# Altium schematic sheet Sheet1.SchDoc
size A; SheetNumber: 1; SheetTotal: 1
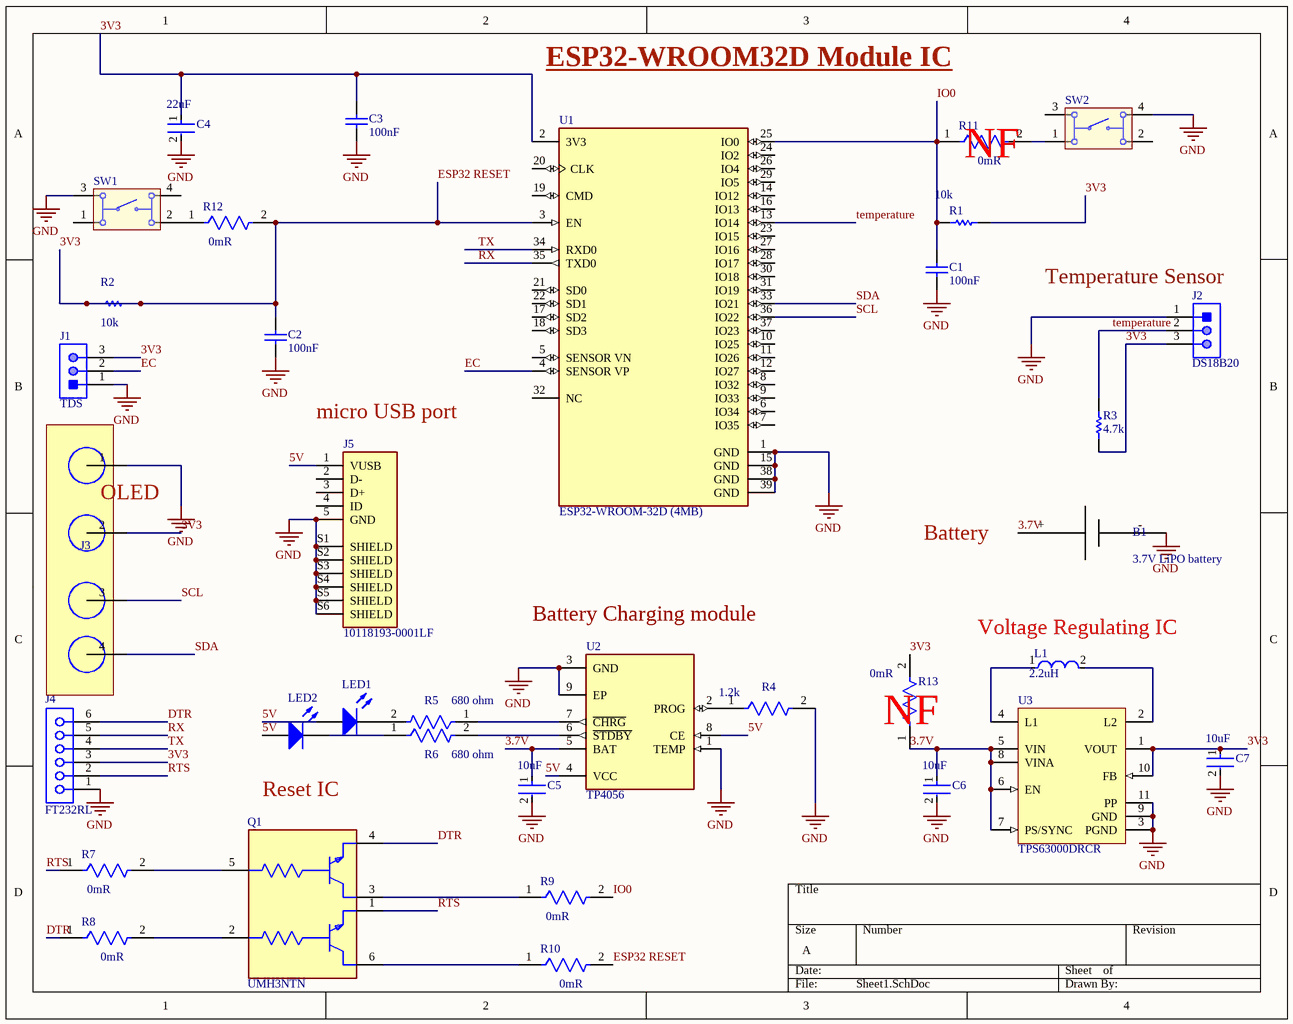
[diagram p0: Sheet1.SchDoc]

## Parts
B1  3.7V LiPO battery  [Battery_lipo]
C1  Capacitance: 100nF  [AVX-MD01]  (hidden comment: MD015E104MAB)
C2  Capacitance: 100nF  [AVX-MD01]  (hidden comment: MD015E104MAB)
C3  Capacitance: 100nF  [AVX-MD01]  (hidden comment: MD015E104MAB)
C4  Capacitance: 22uF  [FP-RCEWM1-MFG]  (hidden comment: RCER71E226MWM1H03A)
C5  Capacitance: 10uF  [FP-RCEWM1-MFG]  (hidden comment: RCER71H106MWK1H03B)
C6  Capacitance: 10uF  [FP-RAD-TH-D_6_3_0_5-L_7_1-MFG]  (hidden comment: ECEA1VKN100)
C7  Capacitance: 10uF  [FP-RAD-TH-D_6_3_0_5-L_7_1-MFG]  (hidden comment: ECEA1VKN100)
J1  TDS  [MOLX-22-23-2031_V]
J2  DS18B20  [MOLX-22-23-2031_V]
J3  OLED  [female header]  (value not drawn)
J4  FT232RL  [SMTC-SSW-106-02-X-S-RA]
J5  10118193-0001LF  [AMPHENOL_10118193-0001LF]
L1  Inductance: 2.2uH  [FP-LQM2HPN_J0-IPC_A]  (hidden comment: LQM2HPN2R2MJ0L)
LED1  151051BS04000  [Type 5mm]  (value not drawn)
LED2  151051BS04000  [Type 5mm]  (value not drawn)
Q1  UMH3NTN  [FP-UMT6-IPC_C]
R1  Resistance (Ohms): 10k  [OMTE-RES7X2.5-2]  (hidden comment: OD103JE)
R2  Resistance (Ohms): 10k  [OMTE-RES7X2.5-2]  (hidden comment: OD103JE)
R3  Resistance (Ohms): 4.7k  [OMTE-RES7X2.5-2]  (hidden comment: OD103JE)
R4  Resistance: 1.2k  [FP-MRS25-MFG]  (hidden comment: MRS25000C9530FCT00)
R5  Resistance: 680 ohm  [FP-MRS25-MFG]  (hidden comment: MRS25000C9530FCT00)
R6  Resistance: 680 ohm  [FP-MRS25-MFG]  (hidden comment: MRS25000C9530FCT00)
R7  Resistance: 0mR  [FP-ZOR-25-R-52-0R-MFG]  (hidden comment: ZOR-25-R-52-0R)
R8  Resistance: 0mR  [FP-ZOR-25-R-52-0R-MFG]  (hidden comment: ZOR-25-R-52-0R)
R9  Resistance: 0mR  [FP-ZOR-25-R-52-0R-MFG]  (hidden comment: ZOR-25-R-52-0R)
R10  Resistance: 0mR  [FP-ZOR-25-R-52-0R-MFG]  (hidden comment: ZOR-25-R-52-0R)
R11  Resistance: 0mR  [FP-ZOR-25-R-52-0R-MFG]  (hidden comment: ZOR-25-R-52-0R)
R12  Resistance: 0mR  [FP-ZOR-25-R-52-0R-MFG]  (hidden comment: ZOR-25-R-52-0R)
R13  Resistance: 0mR  [FP-ZOR-25-R-52-0R-MFG]  (hidden comment: ZOR-25-R-52-0R)
SW1  430156050726  [430156050726]  (value not drawn)
SW2  430156050726  [430156050726]  (value not drawn)
U1  ESP32-WROOM-32D (4MB)  [FP-ESP32-WROOM-32D_4MB-MFG]
U2  TP4056  [SOP127P600X175-9N]
U3  TPS63000DRCR  [DRC0010J_V]

## Nets
GND: B1.-(SDA) C1.1 C2.1 C3.1 C4.2 C5.2 C6.2 C7.2 J1.1 J2.1 J3.1 J4.1 J5.5(GND) J5.S1(SHIELD) J5.S2(SHIELD) J5.S3(SHIELD) J5.S4(SHIELD) J5.S5(SHIELD) J5.S6(SHIELD) R4.2 SW1.3 SW2.4 U1.1(GND) U1.15(GND) U1.38(GND) U1.39(GND) U2.1(TEMP) U2.3(GND) U2.9(EP) U3.3(PGND) U3.9(GND) U3.11(PP)
3.7V: B1.+(SDA) C5.1 C6.1 R13.1 U2.5(BAT) U3.5(VIN) U3.6(EN) U3.7(PS/SYNC) U3.8(VINA)
3V3: C2.2 C3.2 C4.1 C7.1 J1.3 J2.3 J3.2 J4.3 R1.2 R2.1 R2.2 R3.1 R10.2 R12.2 R13.2 U1.2(3V3) U1.3(EN) U3.1(VOUT) U3.10(FB)  [also labelled ESP32 RESET]
5V: J5.1(VUSB) LED1.2(A) LED2.2(A) U2.4(VCC) U2.8(CE)
DTR: J4.6 Q1.4(E) R8.1
EC: J1.2 U1.4(SENSOR_VP)
IO0: C1.2 R1.1 R9.2 R11.1 U1.25(IO0)
RTS: J4.2 Q1.1(E) R7.1
RX: J4.5 U1.35(TXD0)
SCL: J3.3 U1.36(IO22)
SDA: J3.4 U1.33(IO21)
temperature: J2.2 R3.2 U1.13(IO14)
TX: J4.4 U1.34(RXD0)
NetL1_1: L1.1 U3.4(L1)
NetL1_2: L1.2 U3.2(L2)
NetLED1_1: LED1.1(K) R5.2
NetLED2_1: LED2.1(K) R6.1
NetQ1_2: Q1.2(B) R8.2
NetQ1_3: Q1.3(C) R9.1
NetQ1_5: Q1.5(B) R7.2
NetQ1_6: Q1.6(C) R10.1
NetR4_1: R4.1 U2.2(PROG)
NetR5_1: R5.1 U2.7(~{CHRG})
NetR6_2: R6.2 U2.6(~{STDBY})
NetR11_2: R11.2 SW2.1
NetR12_1: R12.1 SW1.2

Not connected (* = marked no-connect by the designer): J5 2(D-) 3(D+) 4(ID); SW1 1 4; SW2 2 3; U1 5(SENSOR_VN) 6(IO34) 7(IO35) 8(IO32) 9(IO33) 10(IO25) 11(IO26) 12(IO27) 14(IO12) 16(IO13) 17(SD2) 18(SD3) 19(CMD) 20(CLK) 21(SD0) 22(SD1) 23(IO15) 24(IO2) 26(IO4) 27(IO16) 28(IO17) 29(IO5) 30(IO18) 31(IO19) 32(NC) 37(IO23)

## Notes on the sheet
- ESP32-WROOM32D Module IC
- (near R11) NF
- (near J2) Temperature Sensor
- (near J5) micro USB port
- (near J3) OLED
- Battery
- (near U2) Battery Charging module
- (near L1) Voltage Regulating IC
- (near R13) NF
- Reset IC

## Library data of the parts
B1 = Battery
C1-C3 = CMP-2000-06690-1: Ceramic Capacitor, 0.1 uF, +/- 20%, 50 V, -55 to 125 degC, 2-Pin THD (MD01), Bulk; Manufacturer: AVX; Dielectric: Z5U; Rated Voltage: 50V; Mounting Technology: ThroughHole; Case Size/Dimension: 6.6x3.43x2.54mm; Package Reference: AVX-MD01; Datasheet URL: http://datasheets.avx.com/dipguard.pdf; Package Description: 2-Pin Through Hole Device, Body 6.6 x 2.54 mm; Datasheet Version: 08/2015; Tolerance (%): ±20%; Manufacturer URL: http://www.avx.com/
C4 = CMP-06035-003622-1: CAP CER 22UF 25V X7R RADIAL; Tolerance: 20%; Lead Diameter: 0.5mm; Lead/Base Style: Formed Leads; Height - Seated (Max): 0.295inch; Height: 7.5mm; Max Operating Temperature: 125°C; Package Quantity: 1500; Case/Package: Radial; Length: 0.217inch; Lead Pitch: 0.197inch; Voltage Rating (DC): 25V; Ratings: AEC-Q200; Mount: Through Hole; Packaging: Tape and Reel; Voltage Rating: 25V; Min Operating Temperature: -55°C; Width: 0.157inch; Resistor Type: Ceramic; Termination: Radial; Dielectric: X7R
C5 = CMP-06035-035073-1: Cap Ceramic 10uF 50V X7R ±20% Radial 5mm +125°C Automotive Ammo Pack; Lead/Base Style: Formed Leads; Lead Diameter: 0.5mm; Width: 4mm; Max Operating Temperature: 125°C; Case/Package: Radial; Mount: Through Hole; Depth: 7.5mm; Dielectric: X7R; Tolerance: 20%; Length: 5.5mm; Min Operating Temperature: -55°C; Height: 7.5mm; Ratings: AEC-Q200; Voltage Rating: 50V; Lead Pitch: 0.197inch; Diameter: 5.5mm; Height - Seated (Max): 0.295inch; Voltage: 50V; Resistor Type: Ceramic; Voltage Rating (DC): 50V; Package Quantity: 500; Lead Free: Lead Free; Packaging: Bulk; Termination: Radial
C6 C7 = CMP-05427-001924-1: Aluminum Electrolytic Capacitors (Radial Lead Type) 10uF ±20% 35V; Ripple Current: 30mA; Life (Hours): 1000Hour; Lead Diameter: 0.45mm; Diameter: 6.3mm; Construction: RADIAL; Lead Pitch: 2.5mm; Height: 7mm; Max Operating Temperature: 85°C; Packaging: Bulk; Case/Package: Radial; Tolerance: 20%; Min Operating Temperature: -40°C; Mount: Through Hole; Termination: Radial; RoHS Compliant: Yes; Radiation Hardening: No
J1 J2 = CMP-2000-05242-1: Male Header, Pitch 2.54 mm, 1 x 3 Position, Height 8.18 mm, Tail Length 3.56 mm, RoHS, Bulk; Current Rating: 4A; Brand: Molex; Pitch: 2.54mm; Voltage Rating: 250V; Mounting Angle: Vertical; Type: Locking; Factory Pack Quantity: 16000; Tradename: KK; Housing Material: Nylon; Contact Material: Brass; Manufacturer URL: http://www.molex.com/; Termination Style: ThroughHole; Mounting Style: ThroughHole; Number of Positions: 3Position; Contact Gender: Pin(Male); Packaging: Bulk; Series: 6373; Datasheet Version: Sep-01; Contact Plating: Tin; Product: Headers; Datasheet URL: https://datasheet.ciiva.com/19472/232274-19472863.pdf; RoHS: Details; Product Category: Headers&WireHousings; Manufacturer: Molex; Number of Rows: 1Row
J3 = 4 PIN FEMALE HEADER
J4 = CMP-1023-00363-1: SSW-106-02-G-S-RA, SQ Post Socket, Through-hole, Right Angle, -55 to 125 degC, 2.54mm Pitch, 6-Pin, Female, RoHS; Manufacturer: Samtec; ComponentLink3URL: http://www.samtec.com/documents/webfiles/cpdf/SSW-1XX-XX-XXX-X-XX-XXX-XX-MKT.pdf; PackageVersion: CA, 6/1987; PartNumber: SSW-106-02-G-S-RA; ComponentLink2URL: http://www.samtec.com/documents/webfiles/pdf/SSW_TH.PDF; Mounting Technology: Through-hole; ComponentLink2Description: Datasheet; Pitch: 2.54 mm; RoHS: True; ComponentLink1URL: http://www.samtec.com; Temperature Range: -55 to 125 degC; ComponentLink3Description: Package Specification; DatasheetVersion: F-214; ComponentLink1Description: Manufacturer URL; PackageReference: SSW-106-02-X-S-RA; Orientation: Right Angle; PackageDescription: Assembly, Socket Strip .016 X .031 Tail
L1 = CMP-06042-016476-1: Multilayer Type Inductor for Power Lines, 1008 (2520), 2.2μH, 20%, 0.15Ω, 1000mA; Current Rating: 1A; Self Resonant Frequency: 40MHz; Test Frequency: 1MHz; Shielding: Shielded; Core Material: Ferrite; Current: 140mA; DC Resistance (DCR): 120mR; Tolerance: 20%; Case Code (Metric): 2520; Inductance Tolerance: 20%; Length: 2.5mm; Depth: 2.2mm; Max Operating Temperature: 125°C; Min Operating Temperature: -55°C; REACH SVHC: No SVHC; Package Quantity: 1; Width: 2mm; Lead Free: Lead Free; Military Standard: Not; Mount: Surface Mount; Packaging: Tape and Reel; Radiation Hardening: No; Series: LQM2HP_J0; Termination: SMD/SMT; Max DC Current: 1A; Case/Package: 1008; Height: 1.1mm; Rated Current-Max: 1A; DC Current: 1A; Case Code (Imperial): 1008
LED1 LED2 = CMP-1488-00009-1: THT LED round mono-color color lens, WL-TMRW, Blue; Manufacturer: Wuerth Elektronik; PackageReference: Type 5mm; ComponentLink2Description: Datasheet; ComponentLink1Description: Manufacturer URL; Emitting color: Blue; ComponentLink1URL: http://www.we-online.com; PartNumber: 151051BS04000; ComponentLink2URL: http://katalog.we-online.de/pbs/datasheet/7448042001.pdfhttp://katalog.we-online.de/pbs/datasheet/7448042001.pdfhttp://katalog.we-online.de/pbs/datasheet/7448042001.pdfhttp://katalog.we-online.de/pbs/datasheet/151051BS04000.pdf
Q1 = CMP-08979-000010-1: TRANS 2NPN PREBIAS 0.15W UMT6; Transition Frequency: 250MHz; Collector Base Voltage (VCBO): 50V; Element Configuration: Dual; Emitter Base Voltage (VEBO): 5V; Max Collector Current: 100mA; Polarity: NPN; hFE Min: 100; Max Power Dissipation: 150mW; Collector-emitter Voltage-Max: 300mV; Collector Emitter Voltage (VCEO): 50V; Package Quantity: 1; Series: -; Case/Package: SOT-363; REACH SVHC: No SVHC; Number of Pins: 6; Operating Supply Voltage: 50V; Min Operating Temperature: -55°C; Mount: Surface Mount; Max Output Current: 100mA; Current Rating: 100mA; Lead Free: Lead Free; Continuous Collector Current: 100mA; Packaging: Tape and Reel; Max Operating Temperature: 150°C; Radiation Hardening: No; Max Breakdown Voltage: 50V; Voltage Rating (DC): 50V; Power Dissipation: 150mW; RoHS Compliant: Yes; Collector Emitter Breakdown Voltage: 50V
R1-R3 = CMP-2000-06865-1: Little Demon(R) Carbon Composition Molded OD Series, 250 V, 10 KOhm, +/-5%, -70 to 130 degC, 2-Pin THD, RoHS, Bulk; Manufacturer: Ohmite; Power Rating: 0.25W; Power (Watts): 0.25W,1/4W; Tolerance: ±5%; Online Catalog: OD,OF,OASeries,LittleDemon®; Catalog Drawings: OD,OF,OASeries; EDA / CAD Models: DownloadfromAcceleratedDesigns; Mounting Technology: ThroughHole; Datasheet Version: 06/2016; RoHS Information: LittleDemon"E"SeriesMaterialDeclaration; Number of Terminations: 2; Temperature Coefficient: -; Height: -; Composition: CarbonComposition; Package Description: 2-Pin THD Resistor, Body 7 x 2.5 mm, Lead Dia. 0.6 mm; Size / Dimension: 0.098"Diax0.276"L(2.50mmx7.00mm); Category: Resistors; Manufacturer URL: http://www.ohmite.com/; Features: PulseWithstanding; Family: ThroughHoleResistors; PartNumber: OD103JE; Supplier Device Package: Axial; Package / Case: Axial; Standard Package: 100; Package Reference: RES7X2.5; Operating Temperature: -; Series: LittleDemon®OD; Datasheet URL: http://www.ohmite.com/cat/res_od_of_oa.pdf; Packaging: Bulk
R4-R6 = CMP-02408-000049-1: RES 953 OHM 0.6W 1% AXIAL; Power Rating: 600mW; Voltage Rating: 350V; Temperature Coefficient: 50ppm/°C; Lead Length: 26mm; Case/Package: Axial; Max Power Dissipation: 600mW; Series: MRS25; Resistance Tolerance: 1%; Packaging: Tape and Reel; Radiation Hardening: No; Min Operating Temperature: -55°C; Contact Plating: Tin; Max Operating Temperature: 155°C; Length: 6.5mm; Number of Terminations: 2; Width: 2.5mm; Construction: Cylindrical; Termination: Axial; RoHS Compliant: Yes; Lead Free: Lead Free; Military Standard: Not; Technology: THIN FILM; Diameter: 2.5mm; Tolerance: 1%; Resistor Type: Metal Film
R7-R13 = CMP-03413-000010-1: RES 0 OHM JUMPER 1/4W AXIAL; Temperature Coefficient: 100ppm/°C; Max Power Dissipation: 250mW; Tolerance: 5%; Case/Package: Axial; Termination: Axial; Series: ZOR; Lead Free: Lead Free; Length: 0.248inch; Military Standard: Not; RoHS Compliant: Yes; Min Operating Temperature: -55°C; Packaging: Tape and Reel; Resistor Type: Carbon Film; Construction: Cylindrical; Package Quantity: 5000; Max Operating Temperature: 155°C; Number of Terminations: 2; Power Rating: 250mW
SW1 SW2 = CMP-1453-00003-1: WS-TATV THT Tact Switch 6X6 mm; Manufacturer: Wuerth Elektronik; NoPins: 04; PartNumber: 430156050726; ComponentLink1URL: http://www.we-online.com; ComponentLink2URL: http://katalog.we-online.de/em/datasheet/4301x6.pdf; ComponentLink1Description: Manufacturer URL; ComponentLink2Description: Datasheet; PackageReference: 430156050726
U1 = CMP-194065-000009-1: RX TXRX MOD WIFI TRACE ANT SMD
U3 = CMP-0345-00001-2: Buck-Boost Voltage Converter with 1.8 to 5.5 V Input and 1.2 to 5.5 V Output, -40 to 85 degC, 10-Pin SON (DRC), Green (RoHS & no Sb/Br); Manufacturer: Texas Instruments; Vout(Max)(V): 5.5; Synchronous Rectification: TRUE; SubFamily: Buck-Boost Regulator; Vin(Min)(V): 1.8; Iq(Typ)(mA): 0.04; Iout(Max)(A): 1.2; Regulated Outputs(#): 1; Switching Frequency(Max)(kHz): 1500; ComponentLink1Description: Datasheet; Mounting Technology: Surface Mount; DatasheetVersion: SLVS520B; Eco-Plan: Green (RoHS & no Sb/Br); PackageVersion: revL, Sep-2011; PackageDescription: 10-Pin Plastic Small Outline No-Lead, 3 x 3 x 1 mm Body, 0.5 mm Pitch, Exposed Pad; Vout(Min)(V): 1.2; Vin(Max)(V): 5.5; Topology: Buck-Boost; Dynamic Voltage Scaling: TRUE; ComponentLink1URL: http://www.ti.com/general/docs/lit/getliterature.tsp?genericPartNumber=TPS63000&fileType=pdf; PartNumber: TPS63000DRCR; ComponentLink2URL: http://www.ti.com/litv/pdf/mpds117k; PackageReference: DRC0010J; ComponentLink2Description: Package Specification